# Altium schematic sheet esp32_ledrgb.SchDoc
size 420 x 297 mm; SheetNumber: 1; SheetTotal: 1
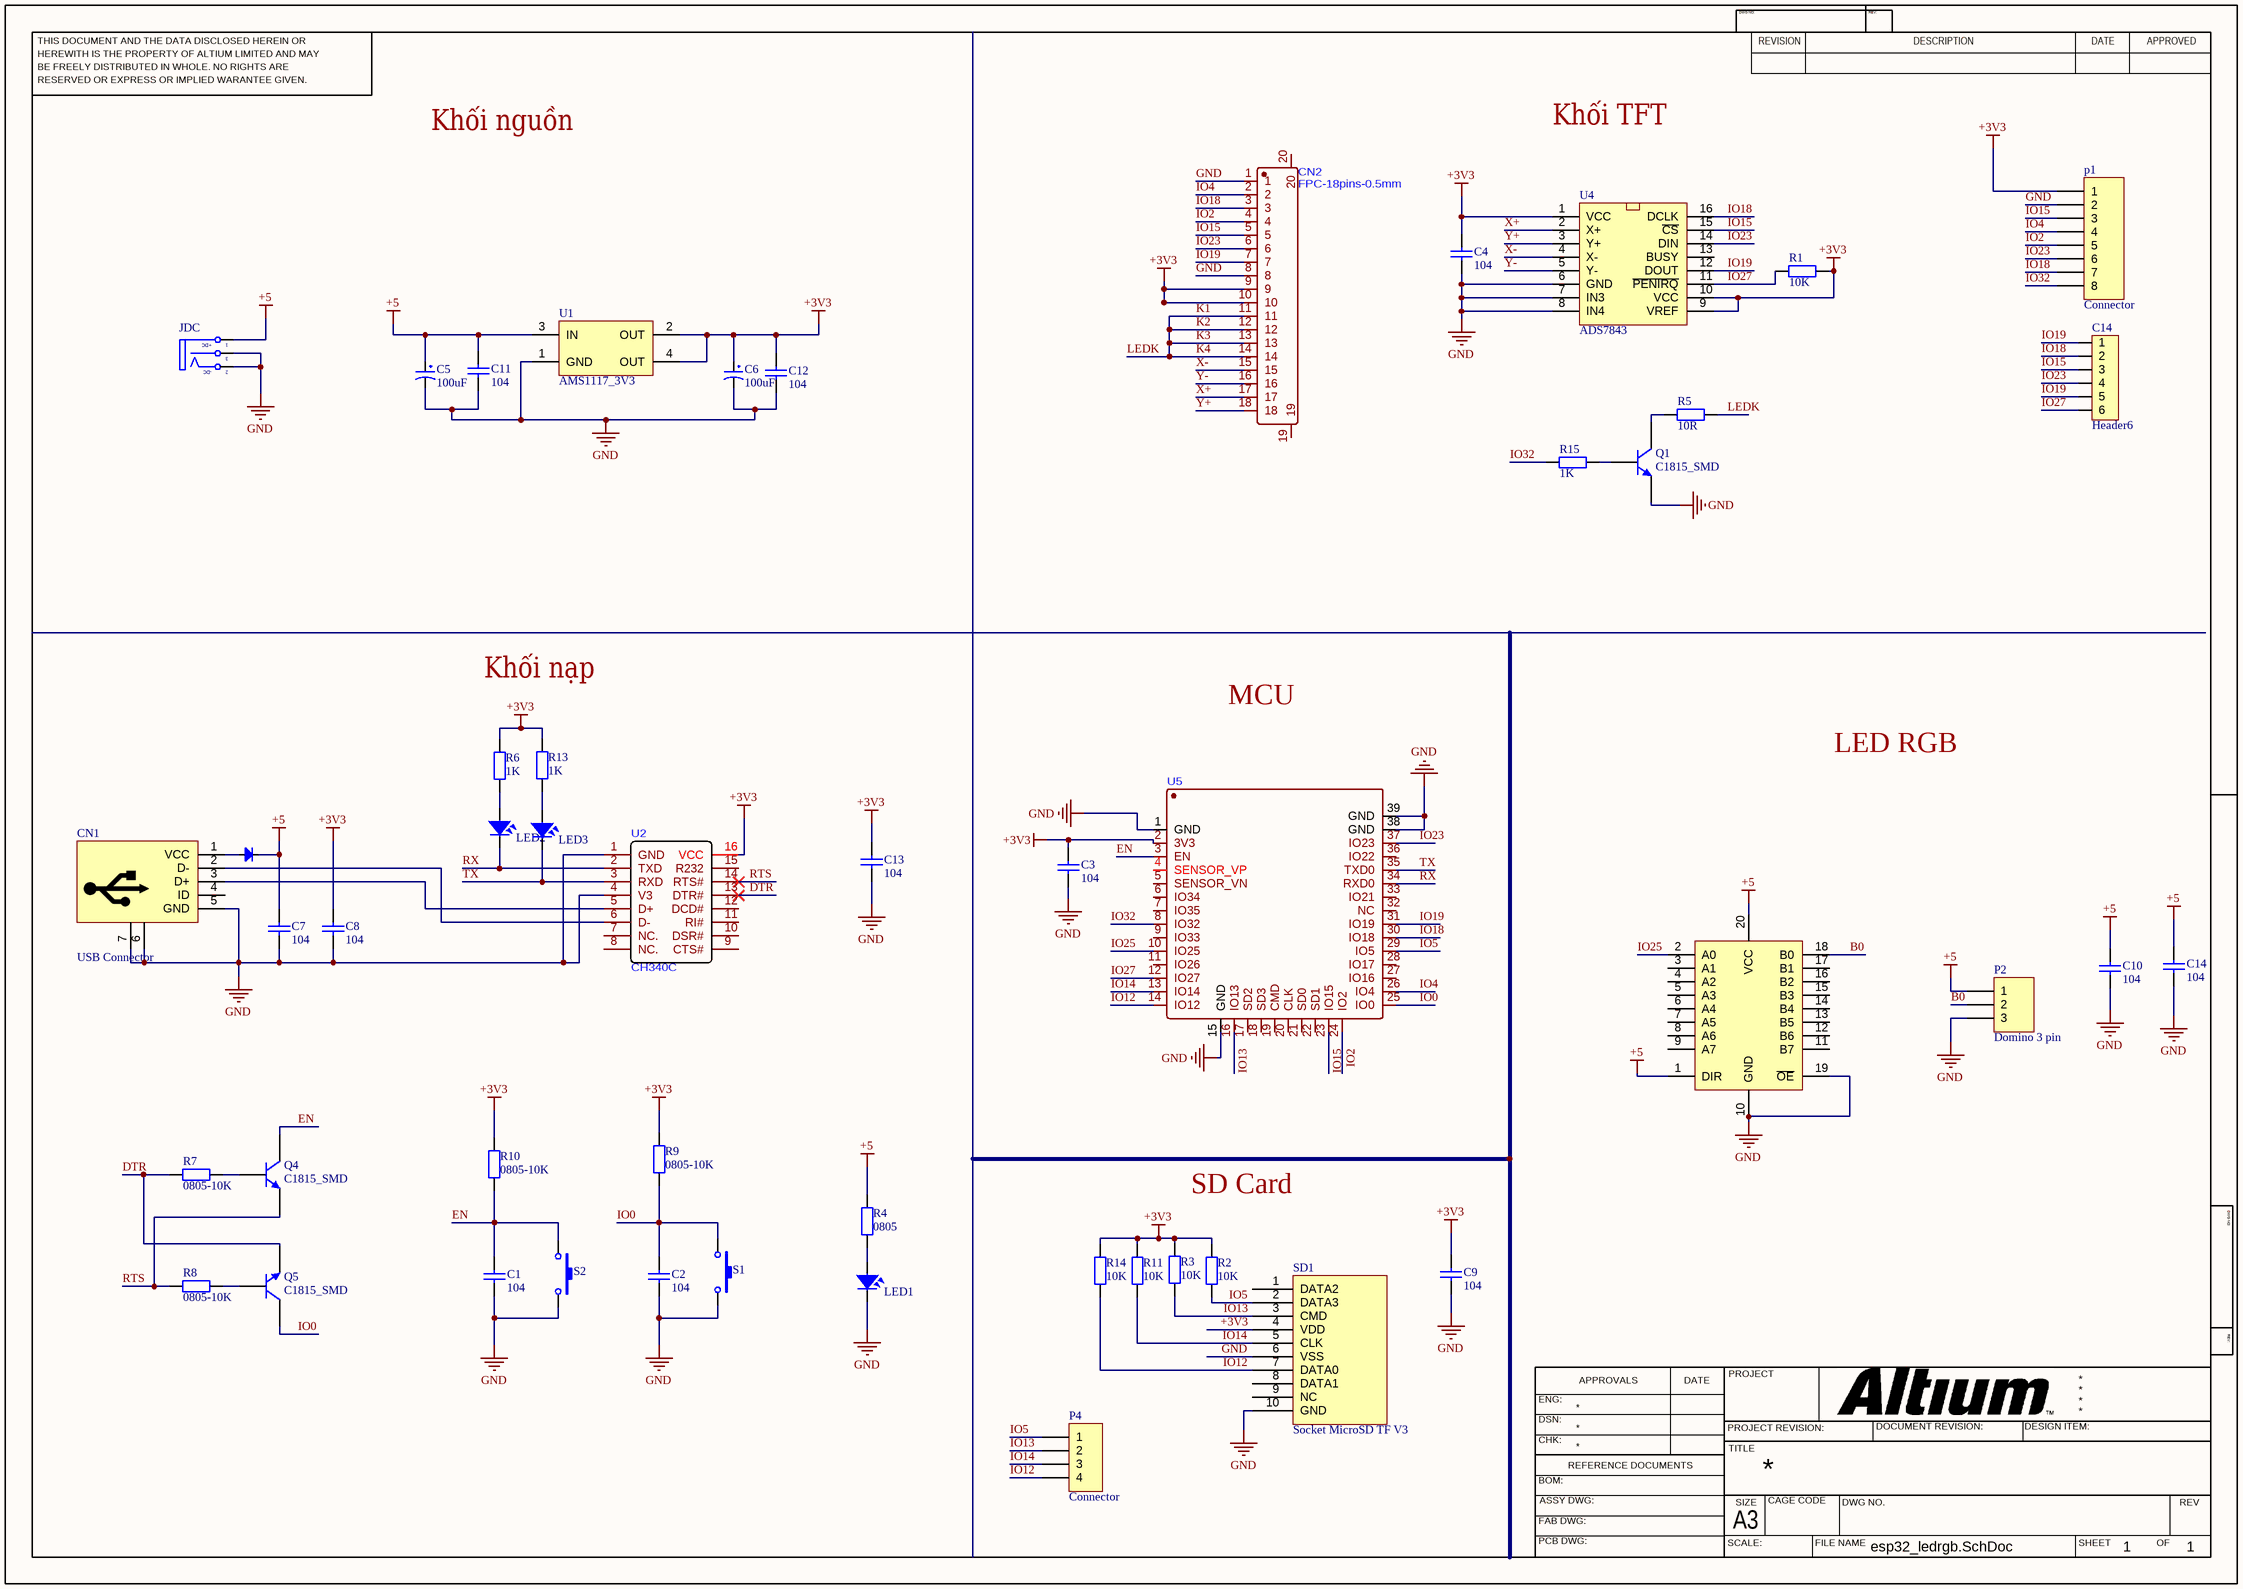
[diagram p0: esp32_ledrgb.SchDoc]

## Parts
(Parts that share a designator on the sheet are numbered #1, #2 ... from top to bottom, then left to right.)
C1  104  [0805]
C2  104  [0805]
C3  104  [0805]
C4  104  [0805]
C5  100uF  [tu hoa 8mm]
C6  100uF  [tu hoa 8mm]
C7  104  [0805]
C8  104  [0805]
C9  104  [0805]
C10  104  [0805]
C11  104  [0805]
C12  104  [0805]
C13  104  [0805]
C14#1  Header6  [HDR6]
C14#2  104  [0805]
CN1  USB Connector  [USB-B-Micro-Hole]
CN2  FPC-18pins-0.5mm  [FPC-SMD_KH-CL0.5-H2.0-18PIN]
DIO1  Diode SMD  [DIO-SMD-106]  (value not drawn)
JDC  Jack DC5.5x2.1  [DC-IN]  (value not drawn)
LED1  LED  [LED-0805-Orange]  (value not drawn)
LED2  LED  [LED-0805-Red]  (value not drawn)
LED3  LED  [LED-0805-Red]  (value not drawn)
p1  Connector  [JST-XH_B8B-XH-A]
P2  Domino 3 pin  [DOMINO_3PIN_5.08MM_RUT]
P4  Connector  [JST-XH_B4B-XH-A]
Q1  C1815_SMD  [SOT23]
Q4  C1815_SMD  [SOT23]
Q5  C1815_SMD  [SOT23]
R1  10K  [DIEN TRO 0805]
R2  value 10K  [DIEN TRO 0805]  (hidden comment: R0805)
R3  value 10K  [DIEN TRO 0805]  (hidden comment: R0805)
R4  value 0805  [DIEN TRO 0805]  (hidden comment: R0805)
R5  value 10R  [DIEN TRO 0805]  (hidden comment: R0805)
R6  value 1K  [DIEN TRO 0805]  (hidden comment: R0805)
R7  value 0805-10K  [DIEN TRO 0805]  (hidden comment: R0805)
R8  value 0805-10K  [DIEN TRO 0805]  (hidden comment: R0805)
R9  value 0805-10K  [DIEN TRO 0805]  (hidden comment: R0805)
R10  value 0805-10K  [DIEN TRO 0805]  (hidden comment: R0805)
R11  value 10K  [DIEN TRO 0805]  (hidden comment: R0805)
R13  value 1K  [DIEN TRO 0805]  (hidden comment: R0805)
R14  value 10K  [DIEN TRO 0805]  (hidden comment: R0805)
R15  value 1K  [DIEN TRO 0805]  (hidden comment: R0805)
S1  MH001036  [SW-SMD]  (value not drawn)
S2  MH001036  [SW-SMD]  (value not drawn)
SD1  Socket MicroSD TF V3  [MicroSD_TF_V3]
U1  AMS1117_3V3  [SOT223-4M]
U2  CH340C  [SOP-16_L10.0-W3.9-P1.27-LS6.0-BL]
U3  74HC245  [SSOP20]  (value not drawn)
U4  ADS7843  [R-PDSO-G16]
U5  ESP32-WROOM-32D-N8  [ESP32-SMD]  (value not drawn)

## Nets
+3V3: C3.2 C4.1 C6.1 C8.2 C9.2 C12.2 C13.2 CN2.9 CN2.10 p1.1 R1.2 R2.1 R3.1 R6.2 R9.2 R10.2 R11.1 R13.2 R14.2 SD1.4(VDD) U1.2(OUT) U1.4(OUT) U2.16(VCC) U4.1(VCC) U4.9(VREF) U4.10(VCC) U5.2(3V3)
+5: C5.1 C7.2 C10.2 C11.2 C14#2.2 DIO1.2(K) JDC.1(T) P2.1 R4.2 U1.3(IN) U3.1(DIR) U3.20(VCC)
GND: C1.1 C2.1 C3.1 C4.2 C5.2 C6.2 C7.1 C8.1 C9.1 C10.1 C11.1 C12.1 C13.1 C14#2.1 CN1.5(GND) CN1.6(SHIELD) CN1.7(SHIELD) CN2.1 CN2.8 JDC.2(TN) JDC.3(S) LED1.2 p1.2 P2.3 Q1.2(E) S1.2 S2.2 SD1.6(VSS) SD1.10(GND) U1.1(GND) U2.1(GND) U2.4(V3) U3.10(GND) U3.19(~{OE}) U4.6(GND) U4.7(IN3) U4.8(IN4) U5.1(GND) U5.15(GND) U5.38(GND) U5.39(GND)
B0: P2.2 U3.18(B0)
DTR: Q5.2(E) R7.1 U2.13(DTR#)
EN: C1.2 Q4.3(C) R10.1 S2.1 U5.3(EN)
IO0: C2.2 Q5.3(C) R9.1 S1.1 U5.25(IO0)
IO2: CN2.4 p1.5 U5.24(IO2)
IO4: CN2.2 p1.4 U5.26(IO4)
IO5: P4.1 R2.2 SD1.2(DATA3) U5.29(IO5)
IO12: P4.4 R14.1 SD1.7(DATA0) U5.14(IO12)
IO13: P4.2 R3.2 SD1.3(CMD) U5.16(IO13)
IO14: P4.3 R11.2 SD1.5(CLK) U5.13(IO14)
IO15: C14#1.3 CN2.5 p1.3 U4.15(~{CS}) U5.23(IO15)
IO18: C14#1.2 CN2.3 p1.7 U4.16(DCLK) U5.30(IO18)
IO19: C14#1.1 C14#1.5 CN2.7 U4.12(DOUT) U5.31(IO19)
IO23: C14#1.4 CN2.6 p1.6 U4.14(DIN) U5.37(IO23)
IO25: U3.2(A0) U5.10(IO25)
IO27: C14#1.6 R1.1 U4.11(~{PENIRQ}) U5.12(IO27)
IO32: p1.8 R15.1 U5.8(IO32)
K1: CN2.11 CN2.12 CN2.13 CN2.14 R5.2  [also labelled K2, K3, K4, LEDK]
RTS: Q4.2(E) R8.1 U2.14(RTS#)
RX: LED2.2 U2.2(TXD) U5.34(RXD0)
TX: LED3.2 U2.3(RXD) U5.35(TXD0)
X+: CN2.17 U4.2(X+)
X-: CN2.15 U4.4(X-)
Y+: CN2.18 U4.3(Y+)
Y-: CN2.16 U4.5(Y-)
NetCN1_1: CN1.1(VCC) DIO1.1(A)
NetCN1_2: CN1.2(D-) U2.6(D-)
NetCN1_3: CN1.3(D+) U2.5(D+)
NetLED1_1: LED1.1 R4.1
NetLED2_1: LED2.1 R6.1
NetLED3_1: LED3.1 R13.1
NetQ1_1: Q1.1(B) R15.2
NetQ1_3: Q1.3(C) R5.1
NetQ4_1: Q4.1(B) R7.2
NetQ5_1: Q5.1(B) R8.2

Not connected (* = marked no-connect by the designer): CN1 4(ID); CN2 19 20; SD1 1(DATA2) 8(DATA1) 9(NC); U2 7(NC.) 8(NC.) 9(CTS#) 10(DSR#) 11(RI#) 12(DCD#) 15(R232); U3 3(A1) 4(A2) 5(A3) 6(A4) 7(A5) 8(A6) 9(A7) 11(B7) 12(B6) 13(B5) 14(B4) 15(B3) 16(B2) 17(B1); U4 13(BUSY); U5 4(SENSOR_VP) 5(SENSOR_VN) 6(IO34) 7(IO35) 9(IO33) 11(IO26) 17(SD2) 18(SD3) 19(CMD) 20(CLK) 21(SD0) 22(SD1) 27(IO16) 28(IO17) 32(NC) 33(IO21) 36(IO22)

## Notes on the sheet
- Khối nguồn
- Khối TFT
- Khối nạp
- MCU
- LED RGB
- SD Card
- THIS DOCUMENT AND THE DATA DISCLOSED HEREIN OR
- HEREWITH IS THE PROPERTY OF ALTIUM LIMITED AND MAY
- DWG NO:
- REVISION
- REV:
- DESCRIPTION
- DATE
- APPROVED
- BE FREELY DISTRIBUTED IN WHOLE. NO RIGHTS ARE
- RESERVED OR EXPRESS OR IMPLIED WARANTEE GIVEN.
- ENG:
- APPROVALS
- PROJECT
- DSN:
- CHK:
- REFERENCE DOCUMENTS
- PROJECT REVISION:
- TITLE
- DOCUMENT REVISION:
- DESIGN ITEM:
- BOM:
- FAB DWG:
- PCB DWG:
- ASSY DWG:
- SCALE:
- A3
- SIZE
- CAGE CODE
- FILE NAME
- DWG NO.
- SHEET
- OF
- REV
- (in symbol Jac_DC) +DC; -DC

## Library data of the parts
C1-C4 C7-C13 C14#2 = Cap 104_SMD: Capacitor (Semiconductor SIM Model); Value: 0.1uF; Published: 8-Jun-2000; LatestRevisionDate: 17-Jul-2002; LatestRevisionNote: Re-released for DXP Platform.; PackageReference: C1206; Publisher: Altium Limited
C5 C6 = Tu Hoa 100uF 50V 8x11: Cắm; Don_Vi: Con; So_Chan: 2; Ten_Linh_Kien: Tụ Hóa 100uF 50V 8x11MM; Ma_Hang: MH006872; Chung_Loai: Cắm; Kieu_Chan: *
C14#1 = Header6: Header IDC, 6 x 1 Pin Vertical 2.54mm Pitch (Non-Boxed, Male); Manufacturer: W¨¹rth Elektronik eiSos GmbH; partNo: 613002143121; ComponentLink1 Description: Manufacturer; ComponentLink2 Description: Datasheet; NoPins: 02; Created Date: 29 March 2013; ComponentLink1URL: http://www.we-online.com; ComponentLink2URL: http://katalog.we-online.de/em/datasheet/6130xx143121.pdf; Created by: Karrer Zheng
CN1 = USB_MICRO_TYPE_B
DIO1 = Diode SMD: Default Diode; Code - JEDEC: DO-214-AB; Value: 1N5007; Published: 8-Jun-2000; Revision: July-2002: Re-released for DXP Platform.; Publisher: Altium Limited
JDC = Jac_DC: Cắm; Ten_Linh_Kien: Jack DC5.5x2.1MM DC5501; Ma_Hang: MH000923; Don_Vi: Con; Kieu_Chan: *; Ghi_Chu: *; Chung_Loai: Cắm
LED1-LED3 = LED SMD: Value: LED 3 - 5 ly 2 Colour
p1 = Connector_8pin
P4 = Connector_4pin
Q1 Q4 Q5 = C1815_SMD: NPN General Purpose Amplifier; Published: 8-Jun-2000; LatestRevisionDate: 15-Jan-2003; LatestRevisionNote: PCB Footprint 'BCY-W3/D4.7' replaced; DatasheetVersion: 1997; PackageVersion: Sep-1998; PackageReference: TO-92A; Publisher: Altium Limited; Code_JEDEC: TO-92A; ComponentLink1Description: Manufacturer Link; ComponentLink1URL: http://www.fairchildsemi.com/; ComponentLink2Description: Datasheet; ComponentLink2URL: http://www.fairchildsemi.com/ds/2N%2F2N3904.pdf
R1-R11 R13-R15 = R0805: Resistor SMD 0805; Published: 8-Jun-2000; LatestRevisionDate: 17-Jul-2002; LatestRevisionNote: Re-released for DXP Platform.; PackageReference: AXIAL-0.4; Publisher: Altium Limited
  R1: Value: 10K
S1 S2 = SW-SMD: Dán; Value: Nút Nhấn 2 Chân 3x6x2.5MM SMD
SD1 = Micro_SD_Card: Dán; Ten_Linh_Kien: Socket MicroSD TF V3 ( Soket Thẻ Nhớ); Don_Vi: Con; Ma_Hang: MH001914; Ghi_Chu: *; Kieu_Chan: *; Chung_Loai: Dán
U1 = AMS1117_3V3: 1A Regulator
U4 = ADS7843: TOUCH SCREEN CONTROLLER